# EAGLE schematic prototype_board (EAGLE 6.2)
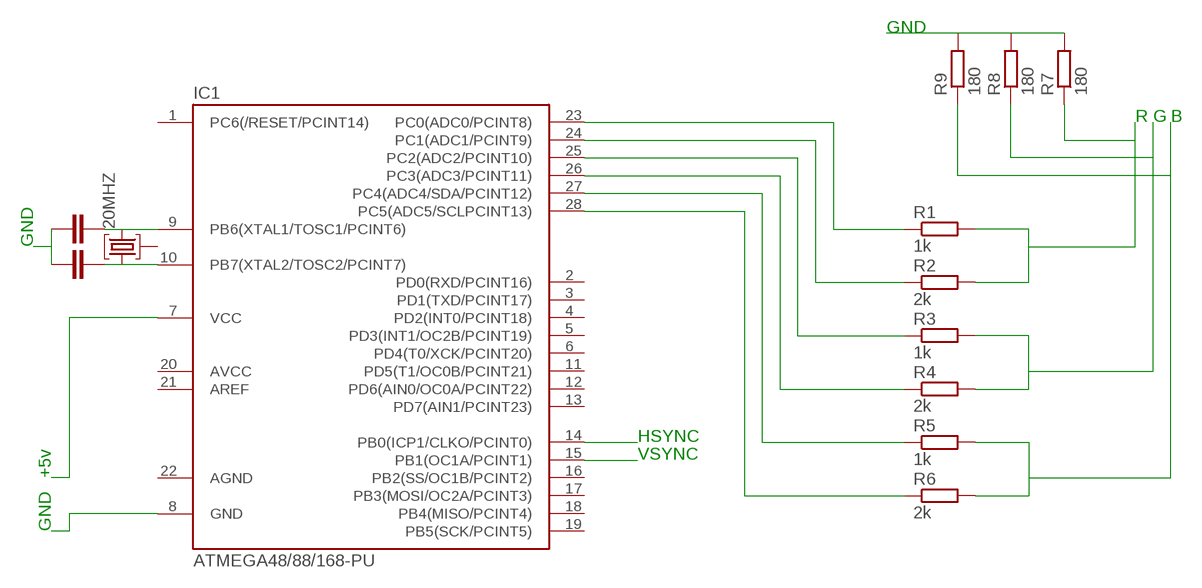
[diagram p0: schematic, sheet 1]

## Parts
20MHZ  16M20AUM1  [UM1]
IC1  ATMEGA48/88/168-PU  [DIL28-3]
R1  1k  R-EU_0309/12  [0309/12]
R2  2k  R-EU_0309/12  [0309/12]
R3  1k  R-EU_0309/12  [0309/12]
R4  2k  R-EU_0309/12  [0309/12]
R5  1k  R-EU_0309/12  [0309/12]
R6  2k  R-EU_0309/12  [0309/12]
R7  180  R-EU_0309/12  [0309/12]
R8  180  R-EU_0309/12  [0309/12]
R9  180  R-EU_0309/12  [0309/12]

## Nets
N$1: IC1.10(PB7(XTAL2/TOSC2/PCINT7))
N$2: IC1.9(PB6(XTAL1/TOSC1/PCINT6))
N$4: R1.2 R2.2 R7.1
N$5: IC1.14(PB0(ICP1/CLKO/PCINT0))
N$6: IC1.15(PB1(OC1A/PCINT1))
N$7: IC1.23(PC0(ADC0/PCINT8)) R1.1
N$8: IC1.24(PC1(ADC1/PCINT9)) R2.1
N$9: IC1.25(PC2(ADC2/PCINT10)) R3.1
N$10: IC1.26(PC3(ADC3/PCINT11)) R4.1
N$11: IC1.27(PC4(ADC4/SDA/PCINT12)) R5.1
N$12: IC1.28(PC5(ADC5/SCLPCINT13)) R6.1
N$13: R5.2 R6.2 R9.1
N$14: R3.2 R4.2 R8.1
N$15: R7.2
N$16: IC1.8(GND)
N$17: IC1.7(VCC)
Unconnected: 20MHZ.1 20MHZ.2 20MHZ.3 IC1.1(PC6(/RESET/PCINT14)) IC1.2(PD0(RXD/PCINT16)) IC1.3(PD1(TXD/PCINT17)) IC1.4(PD2(INT0/PCINT18)) IC1.5(PD3(INT1/OC2B/PCINT19)) IC1.6(PD4(T0/XCK/PCINT20)) IC1.11(PD5(T1/OC0B/PCINT21)) IC1.12(PD6(AIN0/OC0A/PCINT22)) IC1.13(PD7(AIN1/PCINT23)) IC1.16(PB2(SS/OC1B/PCINT2)) IC1.17(PB3(MOSI/OC2A/PCINT3)) IC1.18(PB4(MISO/PCINT4)) IC1.19(PB5(SCK/PCINT5)) IC1.20(AVCC) IC1.21(AREF) R8.2 R9.2

## Notes on the sheet
- GND
- R | G | B
- GND
- HSYNC
- VSYNC
- +5v
- GND

## Power pins joined to a net without a drawn wire
AGND: IC1.22(AGND)

## Library data of the parts
20MHZ = crystal:16M20AUM1: Monolithic Crystal Filters Source: www.vanlong.com; OC_FARNELL: unknown; OC_NEWARK: unknown
IC1 = atmega48_88_168:ATMEGA48/88/168-PU
R1-R9 = resistor:R-EU_: RESISTOR, European symbol